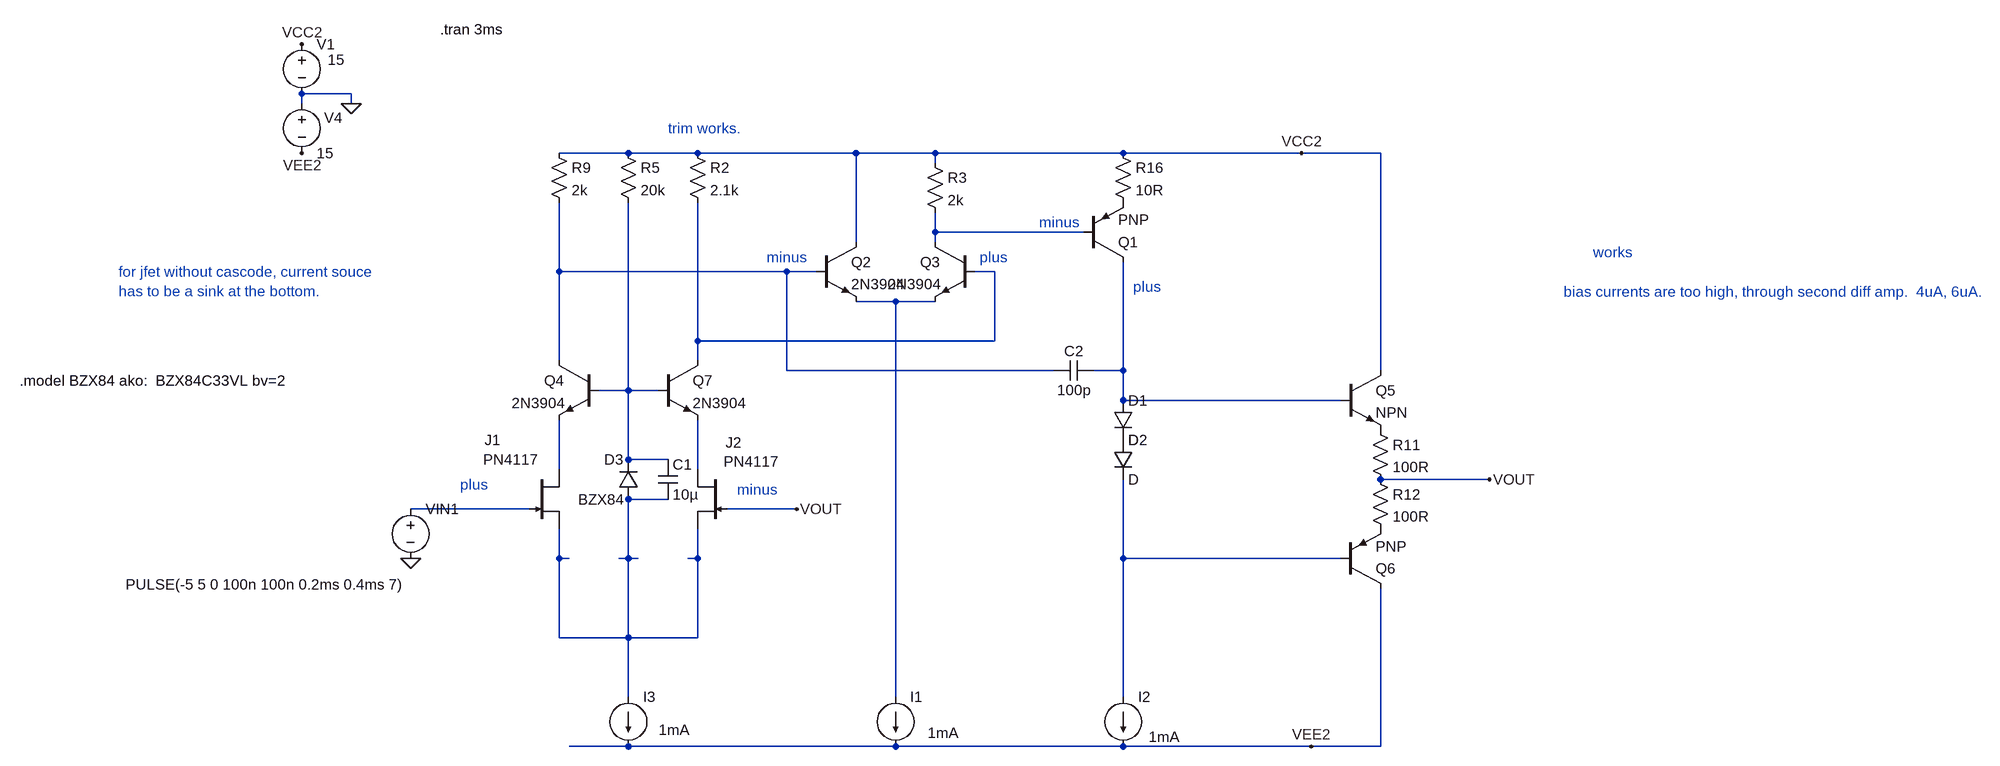
[diagram p0: schematic Draft47.asc]
Draft47.asc, the LTspice schematic file:
Version 4
SHEET 1 2428 952
WIRE -256 -288 -336 -288
WIRE -336 -272 -336 -288
WIRE -256 -272 -256 -288
WIRE 192 -192 80 -192
WIRE 304 -192 192 -192
WIRE 560 -192 304 -192
WIRE 688 -192 560 -192
WIRE 992 -192 688 -192
WIRE 1280 -192 992 -192
WIRE 1408 -192 1280 -192
WIRE 688 -176 688 -192
WIRE 688 -64 688 -96
WIRE 928 -64 688 -64
WIRE 560 -48 560 -192
WIRE 688 -48 688 -64
WIRE 80 0 80 -112
WIRE 448 0 80 0
WIRE 496 0 448 0
WIRE 784 0 752 0
WIRE 624 48 560 48
WIRE 688 48 624 48
WIRE 304 112 304 -112
WIRE 784 112 784 0
WIRE 784 112 304 112
WIRE 80 144 80 0
WIRE 304 144 304 112
WIRE 448 160 448 0
WIRE 880 160 448 160
WIRE 992 160 992 -16
WIRE 992 160 944 160
WIRE 1408 160 1408 -192
WIRE 192 192 192 -112
WIRE 192 192 144 192
WIRE 240 192 192 192
WIRE 992 208 992 160
WIRE 1344 208 992 208
WIRE 192 304 192 192
WIRE 256 304 192 304
WIRE 80 320 80 240
WIRE 304 320 304 240
WIRE 1584 336 1408 336
WIRE 256 368 192 368
WIRE 32 384 -160 384
WIRE 464 384 352 384
WIRE 80 464 80 416
WIRE 96 464 80 464
WIRE 192 464 192 368
WIRE 192 464 176 464
WIRE 208 464 192 464
WIRE 304 464 304 416
WIRE 304 464 288 464
WIRE 992 464 992 336
WIRE 1344 464 992 464
WIRE 80 592 80 464
WIRE 192 592 192 464
WIRE 192 592 80 592
WIRE 304 592 304 464
WIRE 304 592 192 592
WIRE 192 688 192 592
WIRE 624 688 624 48
WIRE 992 688 992 464
WIRE 192 768 96 768
WIRE 624 768 192 768
WIRE 992 768 624 768
WIRE 1296 768 992 768
WIRE 1408 768 1408 512
WIRE 1408 768 1296 768
FLAG -256 -272 0
FLAG -336 -368 VCC2
FLAG -336 -192 VEE2
FLAG 1280 -192 VCC2
FLAG 1296 768 VEE2
FLAG 1584 336 VOUT
FLAG -160 464 0
FLAG 464 384 VOUT
SYMBOL voltage -336 -384 R0
WINDOW 123 0 0 Left 0
WINDOW 39 0 0 Left 0
WINDOW 3 42 41 Left 2
SYMATTR Value 15
SYMATTR InstName V1
SYMBOL voltage -336 -288 R0
WINDOW 123 0 0 Left 0
WINDOW 39 0 0 Left 0
WINDOW 0 36 39 Left 2
SYMATTR InstName V4
SYMATTR Value 15
SYMBOL npn 1344 160 R0
SYMATTR InstName Q5
SYMBOL res 1392 240 R0
SYMATTR InstName R11
SYMATTR Value 100R
SYMBOL res 1392 320 R0
SYMATTR InstName R12
SYMATTR Value 100R
SYMBOL pnp 1344 512 M180
SYMATTR InstName Q6
SYMBOL voltage -160 368 R0
WINDOW 123 0 0 Left 0
WINDOW 39 0 0 Left 0
WINDOW 3 -461 138 Left 2
SYMATTR Value PULSE(-5 5 0 100n 100n 0.2ms 0.4ms 7)
SYMATTR InstName VIN1
SYMBOL res 64 -208 R0
SYMATTR InstName R9
SYMATTR Value 2k
SYMBOL res 976 -208 R0
SYMATTR InstName R16
SYMATTR Value 10R
SYMBOL diode 976 208 R0
SYMATTR InstName D1
SYMBOL diode 976 272 R0
SYMATTR InstName D2
SYMBOL current 992 688 R0
WINDOW 123 0 0 Left 0
WINDOW 39 0 0 Left 0
WINDOW 3 41 64 Left 2
SYMATTR Value 1mA
SYMATTR InstName I2
SYMBOL njf 32 320 R0
WINDOW 0 -72 -48 Left 2
WINDOW 3 -75 -16 Left 2
SYMATTR InstName J1
SYMATTR Value PN4117
SYMBOL njf 352 320 M0
WINDOW 0 3 -44 Right 2
WINDOW 3 6 -13 Right 2
SYMATTR InstName J2
SYMATTR Value PN4117
SYMBOL current 192 688 R0
WINDOW 123 0 0 Left 0
WINDOW 39 0 0 Left 0
WINDOW 3 49 53 Left 2
SYMATTR Value 1mA
SYMATTR InstName I3
SYMBOL pnp 928 -16 M180
SYMATTR InstName Q1
SYMBOL npn 496 -48 R0
SYMATTR InstName Q2
SYMATTR Value 2N3904
SYMBOL npn 752 -48 M0
SYMATTR InstName Q3
SYMATTR Value 2N3904
SYMBOL current 624 688 R0
WINDOW 123 0 0 Left 0
WINDOW 39 0 0 Left 0
WINDOW 3 52 58 Left 2
SYMATTR Value 1mA
SYMATTR InstName I1
SYMBOL res 288 -208 R0
SYMATTR InstName R2
SYMATTR Value 2.1k
SYMBOL res 672 -192 R0
SYMATTR InstName R3
SYMATTR Value 2k
SYMBOL npn 144 144 M0
SYMATTR InstName Q4
SYMATTR Value 2N3904
SYMBOL npn 240 144 R0
SYMATTR InstName Q7
SYMATTR Value 2N3904
SYMBOL diode 208 368 R180
WINDOW 0 24 64 Left 2
WINDOW 3 24 0 Left 2
SYMATTR InstName D3
SYMATTR Value BZX84
SYMBOL res 176 -208 R0
SYMATTR InstName R5
SYMATTR Value 20k
SYMBOL cap 240 304 R0
SYMATTR InstName C1
SYMATTR Value 10µ
SYMBOL cap 944 144 R90
WINDOW 0 0 32 VBottom 2
WINDOW 3 32 32 VTop 2
SYMATTR InstName C2
SYMATTR Value 100p
TEXT -112 -392 Left 2 !.tran 3ms
TEXT 368 352 Left 2 ;minus
TEXT -632 0 Left 2 ;for jfet without cascode, current souce \nhas to be a sink at the bottom.
TEXT -80 344 Left 2 ;plus
TEXT 760 -24 Left 2 ;plus
TEXT 856 -80 Left 2 ;minus
TEXT 1008 24 Left 2 ;plus
TEXT -792 176 Left 2 !.model BZX84 ako:  BZX84C33VL bv=2
TEXT 1752 -32 Left 2 ;works
TEXT 416 -24 Left 2 ;minus
TEXT 1704 32 Left 2 ;bias currents are too high, through second diff amp.  4uA, 6uA.
TEXT 256 -232 Left 2 ;trim works.

The netlist it stands for:
* Draft47.asc
V1 VCC2 0 15
V4 0 VEE2 15
Q5 VCC2 N005 P001 0 NPN
R11 P001 VOUT 100R
R12 VOUT P002 100R
Q6 VEE2 N011 P002 0 PNP
VIN1 N010 0 PULSE(-5 5 0 100n 100n 0.2ms 0.4ms 7)
R9 VCC2 N002 2k
R16 VCC2 P003 10R
D1 N005 P004 D
D2 P004 N011 D
I2 N011 VEE2 1mA
J1 N007 N010 N009 PN4117
J2 N008 VOUT N009 PN4117
I3 N009 VEE2 1mA
Q1 N005 N001 P003 0 PNP
Q2 VCC2 N002 N004 0 2N3904
Q3 N001 N003 N004 0 2N3904
I1 N004 VEE2 1mA
R2 VCC2 N003 2.1k
R3 VCC2 N001 2k
Q4 N002 N006 N007 0 2N3904
Q7 N003 N006 N008 0 2N3904
D3 N009 N006 BZX84
R5 VCC2 N006 20k
C1 N006 N009 10µ
C2 N005 N002 100p
.model D D
.lib standard.dio
.model NPN NPN
.model PNP PNP
.lib standard.bjt
.model NJF NJF
.model PJF PJF
.lib standard.jft
.tran 3ms
* minus
* for jfet without cascode, current souce
* has to be a sink at the bottom.
* plus
* plus
* minus
* plus
.model BZX84 ako:  BZX84C33VL bv=2
* works
* minus
* bias currents are too high, through second diff amp.  4uA, 6uA.
* trim works.
.backanno
.end